# Altium schematic sheet sdhc_memory_card.SchDoc
size A
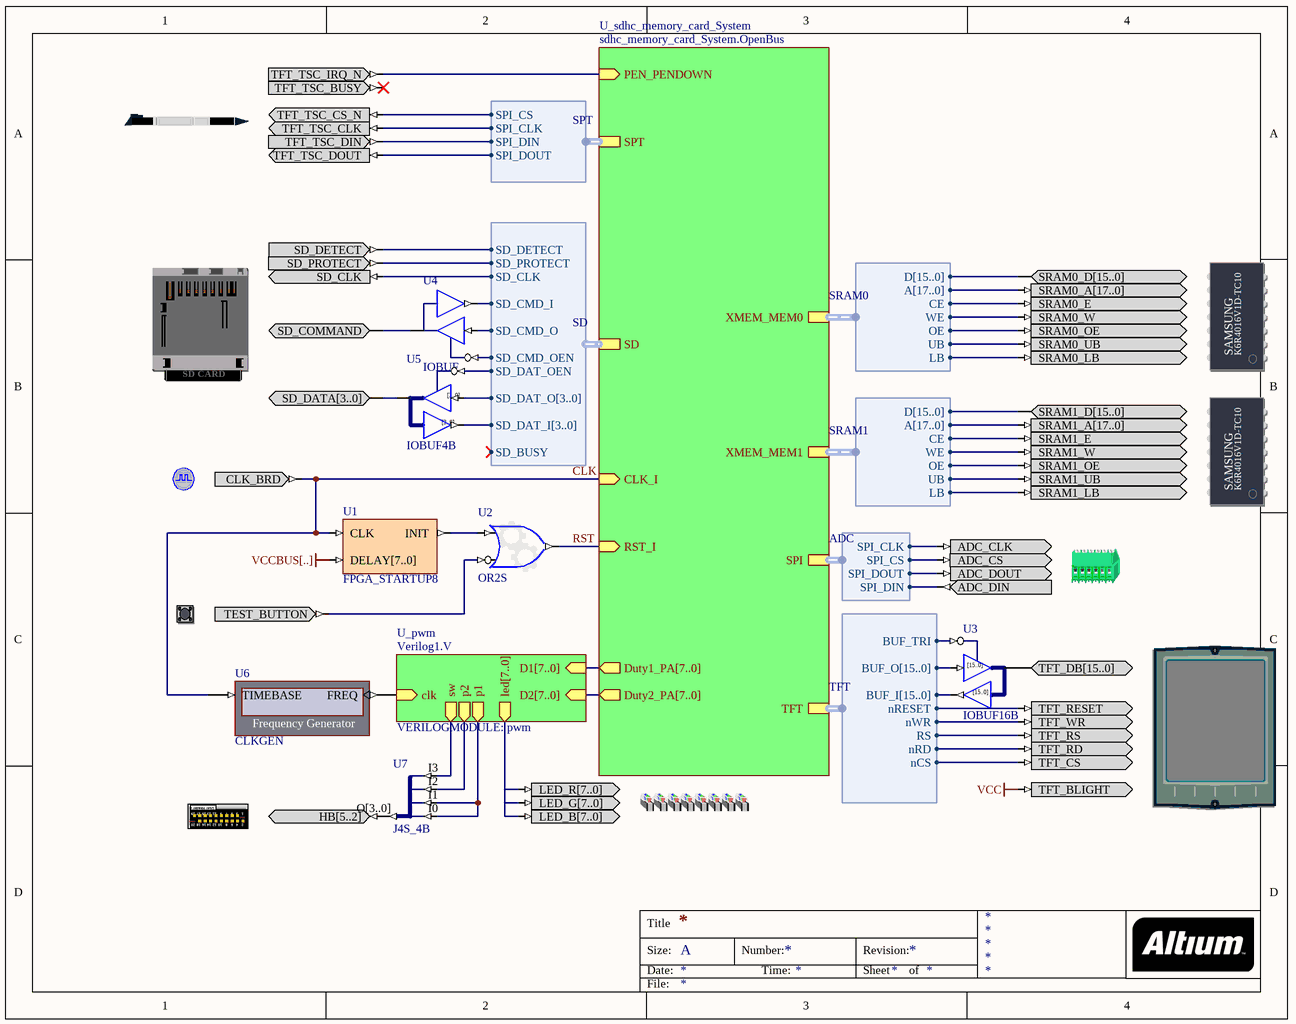
[diagram p0: sdhc_memory_card.SchDoc]

## Parts
(Parts that share a designator on the sheet are numbered #1, #2 ... from top to bottom, then left to right.)
?#1  TOUCH_SCREEN_PEN  (value not drawn)
?#2  SDHC  (value not drawn)
?#3  SRAM_DAUGHTER0  (value not drawn)
?#4  SRAM_DAUGHTER1  (value not drawn)
?#5  CLOCK_BOARD  (value not drawn)
?#6  ADC  (value not drawn)
?#7  TEST_BUTTON  (value not drawn)
?#8  TFT_LCD  (value not drawn)
?#9  LEDS_RGB  (value not drawn)
?#10  USER_HEADER_B  (value not drawn)
U1  FPGA_STARTUP8
U2  OR2S
U3  IOBUF16B
U4  IOBUF
U5  IOBUF4B
U6  CLKGEN
U7  J4S_4B

## Sub-sheets
U_pwm = Verilog1.V: clk (in), D1[7..0] (in), D2[7..0] (in), led[7..0] (out), p1 (out), p2 (out), sw (out)  | VERILOGMODULE: pwm
U_sdhc_memory_card_System = sdhc_memory_card_System.OpenBus: XMEM_MEM0 (harness SRAM0), XMEM_MEM1 (harness SRAM1), SD (harness SD), Duty1_PA[7..0] (out), SPI (harness ADC), TFT (harness TFT), Duty2_PA[7..0] (out), PEN_PENDOWN (in), SPT (harness SPT), RST_I (in), CLK_I (in)

## Harnesses
ADC: SPI_CLK, SPI_CS, SPI_DIN, SPI_DOUT
TFT: BUF_TRI, BUF_O[15..0], BUF_I[15..0], nRESET, nWR, RS, nRD, nCS
SRAM0: D[15..0], A[17..0], CE, WE, OE, UB, LB
SRAM1: D[15..0], A[17..0], CE, WE, OE, UB, LB
SD: SD_DETECT, SD_PROTECT, SD_CLK, SD_CMD_OEN, SD_CMD_O, SD_CMD_I, SD_DAT_OEN, SD_DAT_O[3..0], SD_DAT_I[3..0], SD_BUSY
SPT: SPI_CS, SPI_CLK, SPI_DIN, SPI_DOUT

## Nets
VCC: ?#8.TFT_BLIGHT
VCCBUS[..]: U1.DELAY[7..0]
CLK: ?#5.CLK_BRD U1.CLK U6.TIMEBASE ; sheet U_sdhc_memory_card_System/CLK_I
RST: U2.O ; sheet U_sdhc_memory_card_System/RST_I
Net?#1_TFT_TSC_CLK: ?#1.TFT_TSC_CLK ; sheet U_sdhc_memory_card_System/SPT.SPI_CLK
Net?#1_TFT_TSC_CS_N: ?#1.TFT_TSC_CS_N ; sheet U_sdhc_memory_card_System/SPT.SPI_CS
Net?#1_TFT_TSC_DIN: ?#1.TFT_TSC_DIN ; sheet U_sdhc_memory_card_System/SPT.SPI_DIN
Net?#1_TFT_TSC_DOUT: ?#1.TFT_TSC_DOUT ; sheet U_sdhc_memory_card_System/SPT.SPI_DOUT
Net?#1_TFT_TSC_IRQ_N: ?#1.TFT_TSC_IRQ_N ; sheet U_sdhc_memory_card_System/PEN_PENDOWN
Net?#2_SD_CLK: ?#2.SD_CLK ; sheet U_sdhc_memory_card_System/SD.SD_CLK
Net?#2_SD_COMMAND: ?#2.SD_COMMAND U4.IO
Net?#2_SD_DATA[3..0]: ?#2.SD_DATA[3..0] U5.IO[3..0]
Net?#2_SD_DETECT: ?#2.SD_DETECT ; sheet U_sdhc_memory_card_System/SD.SD_DETECT
Net?#2_SD_PROTECT: ?#2.SD_PROTECT ; sheet U_sdhc_memory_card_System/SD.SD_PROTECT
Net?#3_SRAM0_A[17..0]: ?#3.SRAM0_A[17..0] ; sheet U_sdhc_memory_card_System/XMEM_MEM0.A[17..0]
Net?#3_SRAM0_D[15..0]: ?#3.SRAM0_D[15..0] ; sheet U_sdhc_memory_card_System/XMEM_MEM0.D[15..0]
Net?#3_SRAM0_E: ?#3.SRAM0_E ; sheet U_sdhc_memory_card_System/XMEM_MEM0.CE
Net?#3_SRAM0_LB: ?#3.SRAM0_LB ; sheet U_sdhc_memory_card_System/XMEM_MEM0.LB
Net?#3_SRAM0_OE: ?#3.SRAM0_OE ; sheet U_sdhc_memory_card_System/XMEM_MEM0.OE
Net?#3_SRAM0_UB: ?#3.SRAM0_UB ; sheet U_sdhc_memory_card_System/XMEM_MEM0.UB
Net?#3_SRAM0_W: ?#3.SRAM0_W ; sheet U_sdhc_memory_card_System/XMEM_MEM0.WE
Net?#4_SRAM1_A[17..0]: ?#4.SRAM1_A[17..0] ; sheet U_sdhc_memory_card_System/XMEM_MEM1.A[17..0]
Net?#4_SRAM1_D[15..0]: ?#4.SRAM1_D[15..0] ; sheet U_sdhc_memory_card_System/XMEM_MEM1.D[15..0]
Net?#4_SRAM1_E: ?#4.SRAM1_E ; sheet U_sdhc_memory_card_System/XMEM_MEM1.CE
Net?#4_SRAM1_LB: ?#4.SRAM1_LB ; sheet U_sdhc_memory_card_System/XMEM_MEM1.LB
Net?#4_SRAM1_OE: ?#4.SRAM1_OE ; sheet U_sdhc_memory_card_System/XMEM_MEM1.OE
Net?#4_SRAM1_UB: ?#4.SRAM1_UB ; sheet U_sdhc_memory_card_System/XMEM_MEM1.UB
Net?#4_SRAM1_W: ?#4.SRAM1_W ; sheet U_sdhc_memory_card_System/XMEM_MEM1.WE
Net?#6_ADC_CLK: ?#6.ADC_CLK ; sheet U_sdhc_memory_card_System/SPI.SPI_CLK
Net?#6_ADC_CS: ?#6.ADC_CS ; sheet U_sdhc_memory_card_System/SPI.SPI_CS
Net?#6_ADC_DIN: ?#6.ADC_DIN ; sheet U_sdhc_memory_card_System/SPI.SPI_DIN
Net?#6_ADC_DOUT: ?#6.ADC_DOUT ; sheet U_sdhc_memory_card_System/SPI.SPI_DOUT
Net?#7_TEST_BUTTON: ?#7.TEST_BUTTON U2.I1
Net?#8_TFT_CS: ?#8.TFT_CS ; sheet U_sdhc_memory_card_System/TFT.nCS
Net?#8_TFT_DB[15..0]: ?#8.TFT_DB[15..0] U3.IO[15..0]
Net?#8_TFT_RD: ?#8.TFT_RD ; sheet U_sdhc_memory_card_System/TFT.nRD
Net?#8_TFT_RESET: ?#8.TFT_RESET ; sheet U_sdhc_memory_card_System/TFT.nRESET
Net?#8_TFT_RS: ?#8.TFT_RS ; sheet U_sdhc_memory_card_System/TFT.RS
Net?#8_TFT_WR: ?#8.TFT_WR ; sheet U_sdhc_memory_card_System/TFT.nWR
Net?#9_LED_B[7..0]: ?#9.LED_B[7..0] ?#9.LED_G[7..0] ?#9.LED_R[7..0] ; sheet U_pwm/led[7..0]
Net?#10_HB[5..2]: ?#10.HB[5..2] U7.O[3..0]
NetU1_INIT: U1.INIT U2.I0
NetU3_I[15..0]: U3.I[15..0] ; sheet U_sdhc_memory_card_System/TFT.BUF_O[15..0]
NetU3_O[15..0]: U3.O[15..0] ; sheet U_sdhc_memory_card_System/TFT.BUF_I[15..0]
NetU3_T: U3.T ; sheet U_sdhc_memory_card_System/TFT.BUF_TRI
NetU4_I: U4.I ; sheet U_sdhc_memory_card_System/SD.SD_CMD_O
NetU4_O: U4.O ; sheet U_sdhc_memory_card_System/SD.SD_CMD_I
NetU4_T: U4.T ; sheet U_sdhc_memory_card_System/SD.SD_CMD_OEN
NetU5_I[3..0]: U5.I[3..0] ; sheet U_sdhc_memory_card_System/SD.SD_DAT_O[3..0]
NetU5_O[3..0]: U5.O[3..0] ; sheet U_sdhc_memory_card_System/SD.SD_DAT_I[3..0]
NetU5_T: U5.T ; sheet U_sdhc_memory_card_System/SD.SD_DAT_OEN
NetU6_FREQ: U6.FREQ ; sheet U_pwm/clk
NetU7_I0: U7.I0 U7.I1 ; sheet U_pwm/p1
NetU7_I2: U7.I2 ; sheet U_pwm/p2
NetU7_I3: U7.I3 ; sheet U_pwm/sw

Not connected (* = marked no-connect by the designer): ?#1 TFT_TSC_BUSY*

## Buses and harness runs
bus sheet U_pwm/D1[7..0] = sheet U_sdhc_memory_card_System/Duty1_PA[7..0]
bus sheet U_pwm/D2[7..0] = sheet U_sdhc_memory_card_System/Duty2_PA[7..0]

## Notes on the sheet
- Title
- Size:
- Date:
- A
- Number:
- Time:
- Revision:
- Sheet
- of
- File:
- (in symbol IOBUF4B) [3..0]
- (in symbol IOBUF16B) [15..0]
- (in symbol SDHC) SD CARD
- (in symbol SRAM_DAUGHTER0) SAMSUNG; K6R4016V1D-TC10
- (in symbol SRAM_DAUGHTER1) SAMSUNG; K6R4016V1D-TC10
- (in symbol USER_HEADER_B) User Header A; 19; 17; 15; 13; 11; 9; 7; 5; 3; 1; GND; VCC; 20; 18; 16; 14; 12; 10; 8; 6; 4; 2

## Library data of the parts
?#1 = TFT_PEN: Touch Screen Pen Control; PortComponent: True; Published: 22-Jan-2007; Publisher: Altium Limited; HelpURL: https://wiki.altium.com/display/ADOH/NanoBoard+3000+-+TFT+LCD+Panel+%28with+Touch+Screen%29
?#2 = SDHC: High Capacity Secure Digital Socket; PortComponent: True; Published: 30-Nov-2009; Publisher: Altium Limited; UseInDSF: True; HelpURL: http://wiki.altium.com/display/ADOH/NanoBoard+3000+-+SD+Card+Reader+%28Host+FPGA%29
?#3 = SRAM_DAUGHTER0: Free Static RAM - Daughterboard; PortComponent: True; Published: 14-May-2007; Publisher: Altium Limited; HelpURL: https://wiki.altium.com/display/ADOH/Daughter+Board+Independent+SRAM
?#4 = SRAM_DAUGHTER1: Free Static RAM - Daughterboard; PortComponent: True; Published: 14-May-2007; Publisher: Altium Limited; HelpURL: https://wiki.altium.com/display/ADOH/Daughter+Board+Independent+SRAM
?#5 = CLOCK_BOARD: Global System Clock Supply; PortComponent: True; Published: 19-Nov-2003; Publisher: Altium Limited; HelpURL: https://wiki.altium.com/display/ADOH/NB2DSK01+-+System+Clocks; UseInDSF: True
?#6 = ADC: Digital Analog Converter; PortComponent: True; Published: 11-Mar-2009; Publisher: Altium Limited; HelpURL: https://wiki.altium.com/display/ADOH/NanoBoard+3000+-+ADC+Interface; UseInDSF: True
?#7 = TEST_BUTTON: Test / Reset Button; PortComponent: True; Published: 19-Nov-2003; Publisher: Altium Limited; HelpURL: https://wiki.altium.com/display/ADOH/NB2DSK01+-+Daughter+Board+Test-Reset+Button
?#8 = TFT_LCD: TFT LCD Panel; PortComponent: True; Published: 22-Jan-2007; Publisher: Altium Limited; HelpURL: https://wiki.altium.com/display/ADOH/NanoBoard+3000+-+TFT+LCD+Panel+%28with+Touch+Screen%29
?#9 = LEDS_RGB: LEDS RGB; PortComponent: True; Published: 11-Mar-2009; Publisher: Altium Limited; HelpURL: https://wiki.altium.com/display/ADOH/NanoBoard+3000+-+RGB+User+LEDs
?#10 = USER_HEADER_B: User Header B; PortComponent: True; Published: 19-Nov-2003; Publisher: Altium Limited; HelpURL: https://wiki.altium.com/display/ADOH/NanoBoard+3000+-+User+IO+Headers
U1 = FPGA_STARTUP8: FPGA Startup With 8 Bit Delay; Published: 9-Dec-2004; Publisher: Altium Limited; HelpURL: CR0119 FPGA_STARTUPx Powerup Delay Unit.pdf; LastRevisionNo: 1.00.00; ComponentLink1Description: Core &Resource Usage; ComponentLink1URL: CR0139 FPGA Peripheral Resource Usage.pdf#page=11
U2 = GATE: Configurable Generic Gate; ConfiguratorName: GENERIC_GATE; ConfigurationParameters: {}Version[1.1]{}GateKind[OR]{}BusInput[False]{}GateInputType[Bit]{}GateOutputOption[Normal]{}BusWidth[8]{}RegisterOutputs[False]{}NegativeClockEdge[False]{}InputCount[2]{}InputInvert0[False]{}InputInvert1[True]{}; LastRevisionNo: 1.00.00; Published: 3-Sep-2008; Publisher: Altium Limited
U3 = IOBUF16B: 16-Bit Input/Output Buffer, Bus Version; SubClass: IOBUF; Enable: Low; Control: Common Control T; PortSize: 16; ArchiveName: GENERIC; VHDLIB_SIM: GENERIC_LIB; Published: 29-Jan-2004; Publisher: Altium Limited; LastRevisionNo: 1.00.00; HelpURL: CR0118 FPGA Generic Library Guide.pdf#page=293; ComponentLink1URL: CR0125 FPGA Buffer Resource Usage.pdf#page=91; ComponentLink1Description: Core &Resource Usage; FunctionalClass: Buffer; PortStyle: Bus Version
U4 = IOBUF: Input/Output Buffer; Enable: Low; Control: Common Control T; ArchiveName: GENERIC; VHDLIB_SIM: GENERIC_LIB; Published: 29-Jan-2004; Publisher: Altium Limited; XilinxEquivalent: IOBUF; LastRevisionNo: 1.00.00; HelpURL: CR0118 FPGA Generic Library Guide.pdf#page=293; ComponentLink1URL: CR0125 FPGA Buffer Resource Usage.pdf#page=78; ComponentLink1Description: Core &Resource Usage; FunctionalClass: Buffer; SubClass: IOBUF
U5 = IOBUF4B: 4-Bit Input/Output Buffer, Bus Version; SubClass: IOBUF; Enable: Low; Control: Common Control T; PortSize: 4; ArchiveName: GENERIC; VHDLIB_SIM: GENERIC_LIB; Published: 29-Jan-2004; Publisher: Altium Limited; LastRevisionNo: 1.00.00; HelpURL: CR0118 FPGA Generic Library Guide.pdf#page=293; ComponentLink1URL: CR0125 FPGA Buffer Resource Usage.pdf#page=82; ComponentLink1Description: Core &Resource Usage; FunctionalClass: Buffer; PortStyle: Bus Version
U6 = CLKGEN: Frequency Generator; NEXUS_CORE: Instrument; NEXUS_JTAG_DEVICE: True; NEXUS_JTAG_ORDER: 0; Published: 3-Nov-2004; Publisher: Altium Limited; Core Revision: 1.00.00; ComponentLink1Description: Core &Resource Usage; ComponentLink1URL: CR0134 FPGA Instrument Resource Usage.pdf#page=2; HelpURL: https://wiki.altium.com/display/ADOH/Frequency+Generator+Module; LastRevisionNo: 1.00.00
U7 = J4S_4B: 4 Single pin inputs to single 4-Bit output bus; FunctionalClass: Bus Joiner; PortSize: 4; ArchiveName: GENERIC; VHDLIB_SIM: GENERIC_LIB; Published: 29-Jan-2004; Publisher: Altium Limited; LastRevisionNo: 1.00.00; HelpURL: CR0118 FPGA Generic Library Guide.pdf#page=306; ComponentLink1URL: CR0126 FPGA Bus Joiner Resource Usage.pdf#page=12; ComponentLink1Description: Core &Resource Usage